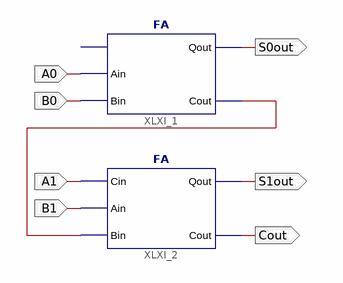
[diagram p0: schematic sheet 1]
// Xilinx ISE schematic adder2b.sch (spartan3e) as structural Verilog: 2 symbols, 7 ports
module adder2b (
  input  A1,
  input  B1,
  input  A0,
  input  B0,
  output S1out,
  output Cout,
  output S0out
);

  wire XLXN_5;

  FA XLXI_2 (.Cin(A1), .Ain(B1), .Bin(XLXN_5), .Qout(S1out), .Cout(Cout));
  FA XLXI_1 (.Ain(A0), .Bin(B0), .Qout(S0out), .Cout(XLXN_5));  // open: Cin
endmodule
